# Altium project Main_board.PrjPcb
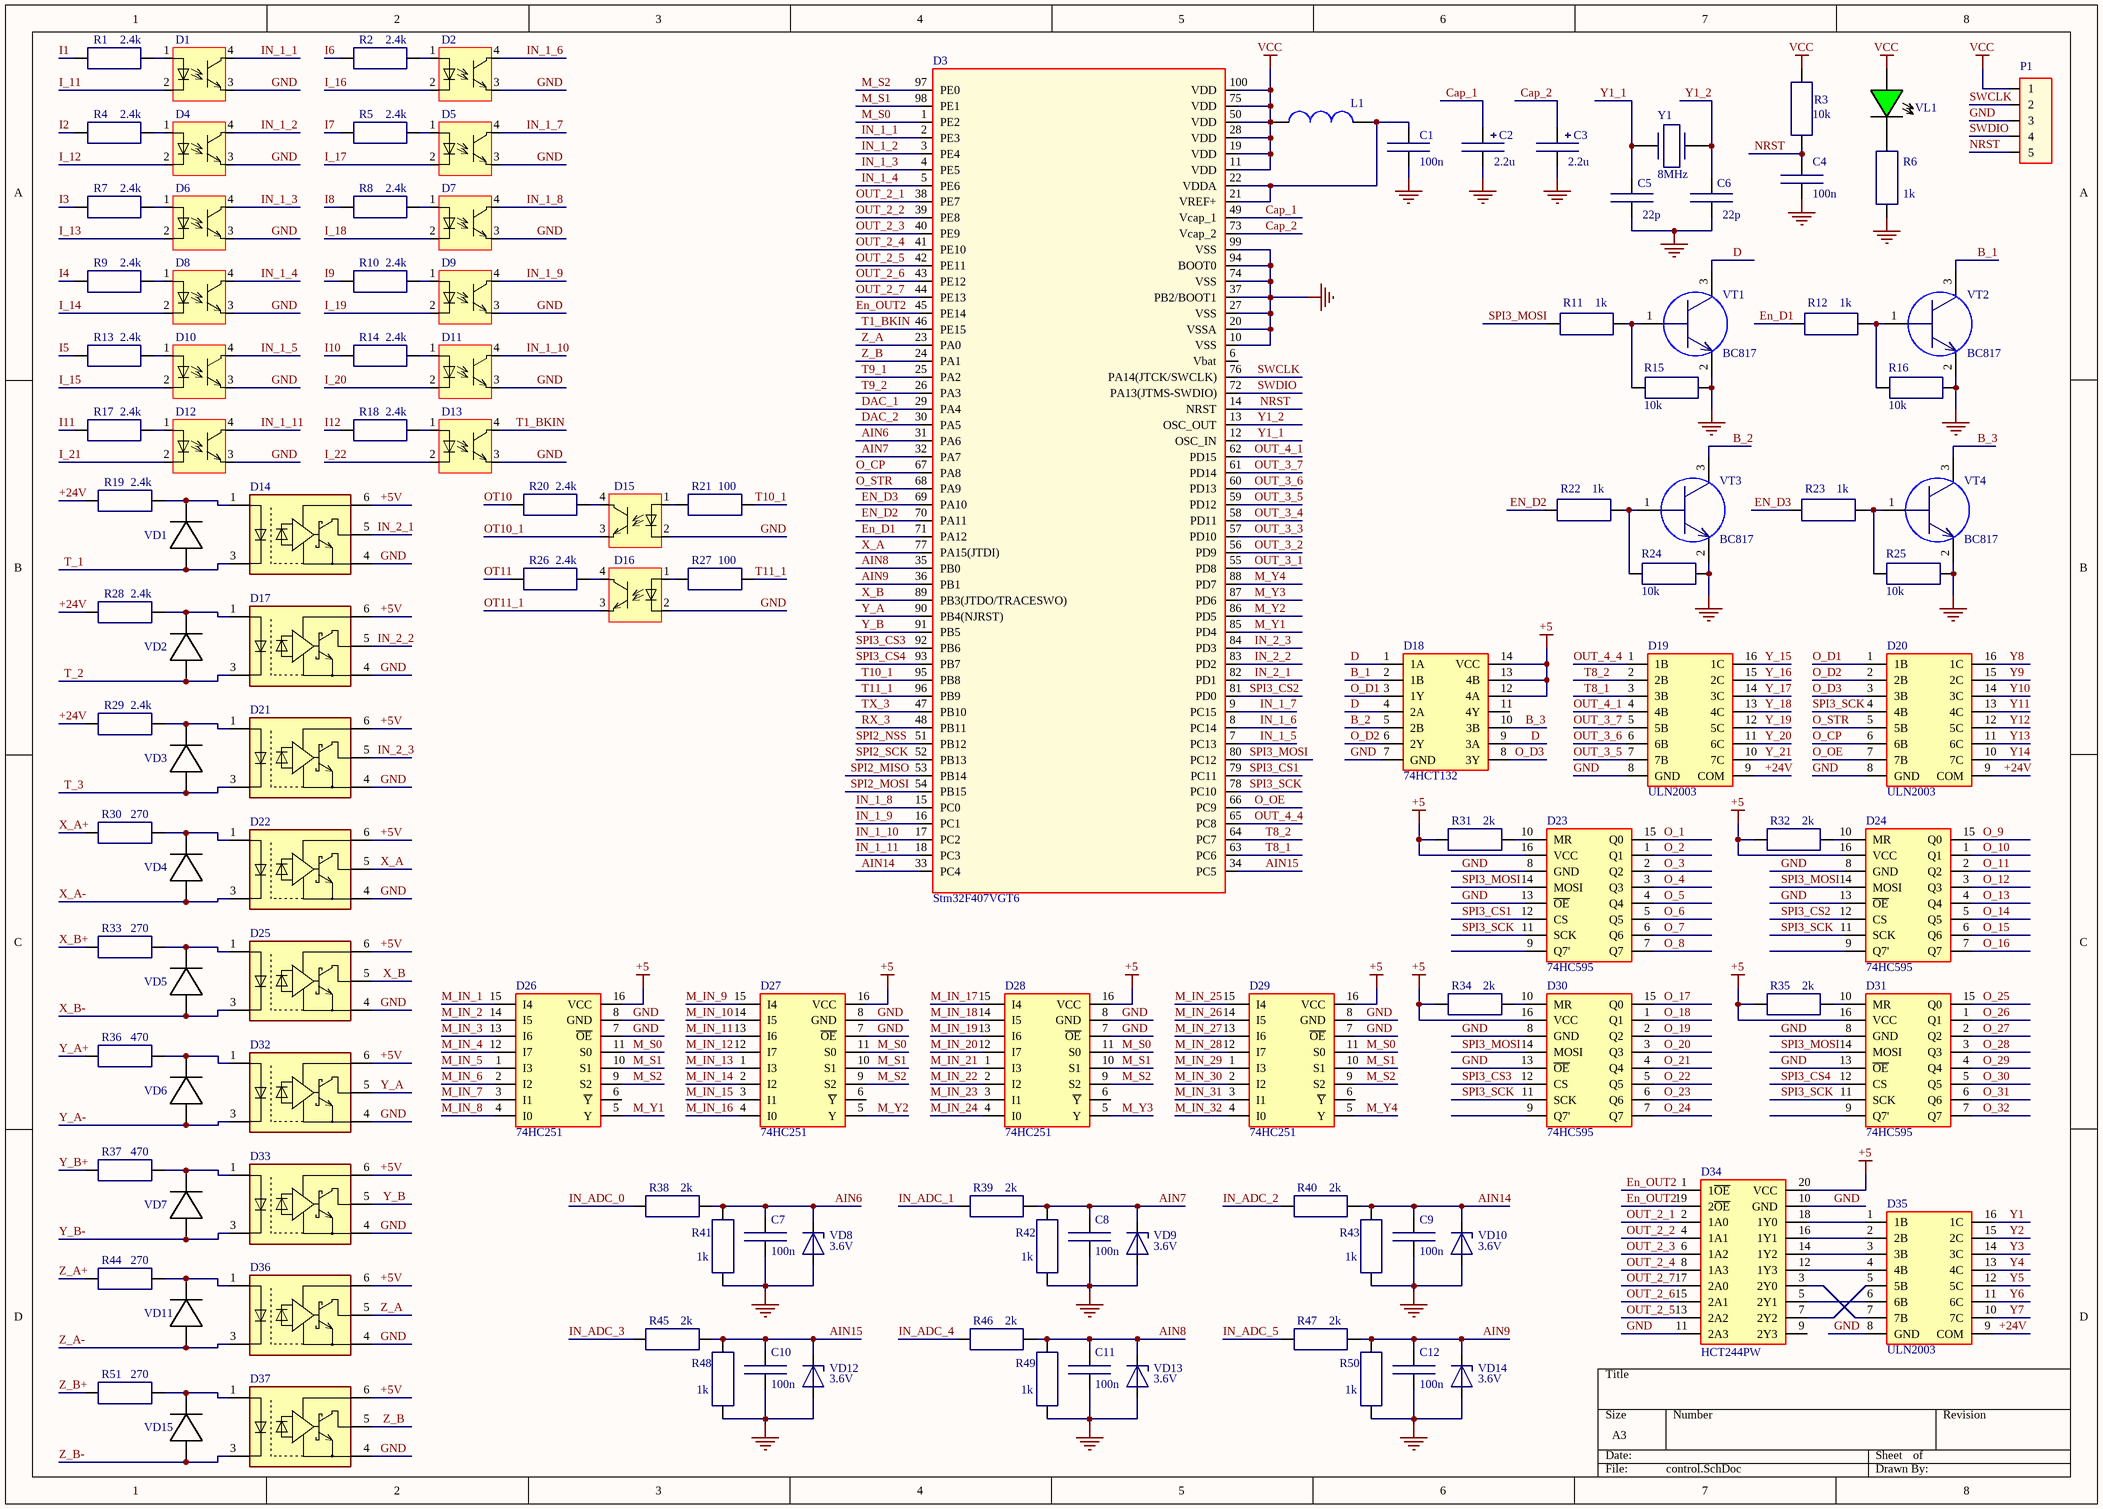
[diagram p0: control.SchDoc]
6 sheets, 333 parts. Net scope: global (net labels, ports and power ports of the same name join across sheets).
Board file: Bender_main.PcbDoc
Sheets:
  control.SchDoc
  control_2.SchDoc
  Res.SchDoc
  Supply.SchDoc
  Task.SchDoc
  connect.SchDoc

## Sheet control.SchDoc
size A3

### Parts
C1  100n  [C0805]
C2  2.2u  [R1206]
C3  2.2u  [R1206]
C4  100n  [C0805]
C5  22p  [C0805]
C6  22p  [C0805]
C7  100n  [C0805]
C8  100n  [C0805]
C9  100n  [C0805]
C10  100n  [C0805]
C11  100n  [C0805]
C12  100n  [C0805]
D1  hcpl-181  [SOP4]  (value not drawn)
D2  hcpl-181  [SOP4]  (value not drawn)
D3  Stm32F407VGT6  [LQFP100]
D4  hcpl-181  [SOP4]  (value not drawn)
D5  hcpl-181  [SOP4]  (value not drawn)
D6  hcpl-181  [SOP4]  (value not drawn)
D7  hcpl-181  [SOP4]  (value not drawn)
D8  hcpl-181  [SOP4]  (value not drawn)
D9  hcpl-181  [SOP4]  (value not drawn)
D10  hcpl-181  [SOP4]  (value not drawn)
D11  hcpl-181  [SOP4]  (value not drawn)
D12  hcpl-181  [SOP4]  (value not drawn)
D13  hcpl-181  [SOP4]  (value not drawn)
D14  LTV-601  [SOP5]  (value not drawn)
D15  hcpl-181  [SOP4]  (value not drawn)
D16  hcpl-181  [SOP4]  (value not drawn)
D17  LTV-601  [SOP5]  (value not drawn)
D18  74HCT132  [SO-14]
D19  ULN2003  [SOIC-16]
D20  ULN2003  [SOIC-16]
D21  LTV-601  [SOP5]  (value not drawn)
D22  LTV-601  [SOP5]  (value not drawn)
D23  74HC595  [SOP16_595]
D24  74HC595  [SOP16_595]
D25  LTV-601  [SOP5]  (value not drawn)
D26  74HC251  [SOP16_595]
D27  74HC251  [SOP16_595]
D28  74HC251  [SOP16_595]
D29  74HC251  [SOP16_595]
D30  74HC595  [SOP16_595]
D31  74HC595  [SOP16_595]
D32  LTV-601  [SOP5]  (value not drawn)
D33  LTV-601  [SOP5]  (value not drawn)
D34  HCT244PW  [TSSOP20]
D35  ULN2003  [SOIC-16]
D36  LTV-601  [SOP5]  (value not drawn)
D37  LTV-601  [SOP5]  (value not drawn)
L1  L  [L]  (value not drawn)
P1  Con_5  [Con_5]  (value not drawn)
R1  2.4k  [R1206]
R2  2.4k  [R1206]
R3  10k  [R0805]
R4  2.4k  [R1206]
R5  2.4k  [R1206]
R6  1k  [R0805]
R7  2.4k  [R1206]
R8  2.4k  [R1206]
R9  2.4k  [R1206]
R10  2.4k  [R1206]
R11  1k  [R0805]
R12  1k  [R0805]
R13  2.4k  [R1206]
R14  2.4k  [R1206]
R15  10k  [R0805]
R16  10k  [R0805]
R17  2.4k  [R1206]
R18  2.4k  [R1206]
R19  2.4k  [R1206]
R20  2.4k  [R1206]
R21  100  [R0805]
R22  1k  [R0805]
R23  1k  [R0805]
R24  10k  [R0805]
R25  10k  [R0805]
R26  2.4k  [R1206]
R27  100  [R0805]
R28  2.4k  [R1206]
R29  2.4k  [R1206]
R30  270  [R0805]
R31  2k  [R0805]
R32  2k  [R0805]
R33  270  [R0805]
R34  2k  [R0805]
R35  2k  [R0805]
R36  470  [R0805]
R37  470  [R0805]
R38  2k  [R0805]
R39  2k  [R0805]
R40  2k  [R0805]
R41  1k  [R0805]
R42  1k  [R0805]
R43  1k  [R0805]
R44  270  [R0805]
R45  2k  [R0805]
R46  2k  [R0805]
R47  2k  [R0805]
R48  1k  [R0805]
R49  1k  [R0805]
R50  1k  [R0805]
R51  270  [R0805]
VD1  LL4448  [R1206]  (value not drawn)
VD2  LL4448  [R1206]  (value not drawn)
VD3  LL4448  [R1206]  (value not drawn)
VD4  LL4448  [R1206]  (value not drawn)
VD5  LL4448  [R1206]  (value not drawn)
VD6  LL4448  [R1206]  (value not drawn)
VD7  LL4448  [R1206]  (value not drawn)
VD8  3.6V  [R1206]
VD9  3.6V  [R1206]
VD10  3.6V  [R1206]
VD11  LL4448  [R1206]  (value not drawn)
VD12  3.6V  [R1206]
VD13  3.6V  [R1206]
VD14  3.6V  [R1206]
VD15  LL4448  [R1206]  (value not drawn)
VL1  LED_1206  [R1206]  (value not drawn)
VT1  BC817  [SOT-23]
VT2  BC817  [SOT-23]
VT3  BC817  [SOT-23]
VT4  BC817  [SOT-23]
Y1  8MHz  [Crystal]

### Nets
+5V: D14.6 D17.6 D18.12(4A) D18.13(4B) D18.14(VCC) D21.6 D22.6 D23.16(VCC) D24.16(VCC) D25.6 D26.16(VCC) D27.16(VCC) D28.16(VCC) D29.16(VCC) D30.16(VCC) D31.16(VCC) D32.6 D33.6 D34.20(VCC) D36.6 D37.6 R31.2 R32.2 R34.2 R35.2  [also labelled +5]
GND: C1.2 C2.2 C3.2 C4.1 C5.2 C6.2 C7.2 C8.2 C9.2 C10.2 C11.2 C12.2 D1.3 D2.3 D3.10(VSS) D3.20(VSSA) D3.27(VSS) D3.37(PB2/BOOT1) D3.74(VSS) D3.94(BOOT0) D3.99(VSS) D4.3 D5.3 D6.3 D7.3 D8.3 D9.3 D10.3 D11.3 D12.3 D13.3 D14.4 D15.2 D16.2 D17.4 D18.7(GND) D19.8(GND) D20.8(GND) D21.4 D22.4 D23.8(GND) D23.13(~{OE}) D24.8(GND) D24.13(~{OE}) D25.4 D26.7(~{OE}) D26.8(GND) D27.7(~{OE}) D27.8(GND) D28.7(~{OE}) D28.8(GND) D29.7(~{OE}) D29.8(GND) D30.8(GND) D30.13(~{OE}) D31.8(GND) D31.13(~{OE}) D32.4 D33.4 D34.10(GND) D34.11(2A3) D35.8(GND) D36.4 D37.4 P1.3 R6.1 R15.1 R16.1 R24.1 R25.1 R41.1 R42.1 R43.1 R48.1 R49.1 R50.1 VD8.1 VD9.1 VD10.1 VD12.1 VD13.1 VD14.1 VT1.2 VT2.2 VT3.2 VT4.2
VCC: D3.11(VDD) D3.19(VDD) D3.28(VDD) D3.50(VDD) D3.75(VDD) D3.100(VDD) L1.1 P1.1 R3.1 VL1.1
+24V: D19.9(COM) D20.9(COM) D35.9(COM) R19.1 R28.1 R29.1
AIN6: C7.1 D3.31(PA6) R38.2 R41.2 VD8.2
AIN7: C8.1 D3.32(PA7) R39.2 R42.2 VD9.2
AIN8: C11.1 D3.35(PB0) R46.2 R49.2 VD13.2
AIN9: C12.1 D3.36(PB1) R47.2 R50.2 VD14.2
AIN14: C9.1 D3.33(PC4) R40.2 R43.2 VD10.2
AIN15: C10.1 D3.34(PC5) R45.2 R48.2 VD12.2
B_1: D18.2(1B) VT2.3
B_2: D18.5(2B) VT3.3
B_3: D18.10(3B) VT4.3
Cap_1: C2.1 D3.49(Vcap_1)
Cap_2: C3.1 D3.73(Vcap_2)
D: D18.1(1A) D18.4(2A) D18.9(3A) VT1.3
DAC_1: D3.29(PA4)
DAC_2: D3.30(PA5)
En_D1: D3.71(PA12) R12.1
EN_D2: D3.70(PA11) R22.1
EN_D3: D3.69(PA10) R23.1
En_OUT2: D3.45(PE14) D34.1(1~{OE}) D34.19(2~{OE})
I1: R1.1
I2: R4.1
I3: R7.1
I4: R9.1
I5: R13.1
I6: R2.1
I7: R5.1
I8: R8.1
I9: R10.1
I10: R14.1
I11: R17.1
I12: R18.1
I_11: D1.2
I_12: D4.2
I_13: D6.2
I_14: D8.2
I_15: D10.2
I_16: D2.2
I_17: D5.2
I_18: D7.2
I_19: D9.2
I_20: D11.2
I_21: D12.2
I_22: D13.2
IN_1_1: D1.4 D3.2(PE3)
IN_1_2: D3.3(PE4) D4.4
IN_1_3: D3.4(PE5) D6.4
IN_1_4: D3.5(PE6) D8.4
IN_1_5: D3.7(PC13) D10.4
IN_1_6: D2.4 D3.8(PC14)
IN_1_7: D3.9(PC15) D5.4
IN_1_8: D3.15(PC0) D7.4
IN_1_9: D3.16(PC1) D9.4
IN_1_10: D3.17(PC2) D11.4
IN_1_11: D3.18(PC3) D12.4
IN_2_1: D3.82(PD1) D14.5
IN_2_2: D3.83(PD2) D17.5
IN_2_3: D3.84(PD3) D21.5
IN_ADC_0: R38.1
IN_ADC_1: R39.1
IN_ADC_2: R40.1
IN_ADC_3: R45.1
IN_ADC_4: R46.1
IN_ADC_5: R47.1
M_IN_1: D26.15(I4)
M_IN_2: D26.14(I5)
M_IN_3: D26.13(I6)
M_IN_4: D26.12(I7)
M_IN_5: D26.1(I3)
M_IN_6: D26.2(I2)
M_IN_7: D26.3(I1)
M_IN_8: D26.4(I0)
M_IN_9: D27.15(I4)
M_IN_10: D27.14(I5)
M_IN_11: D27.13(I6)
M_IN_12: D27.12(I7)
M_IN_13: D27.1(I3)
M_IN_14: D27.2(I2)
M_IN_15: D27.3(I1)
M_IN_16: D27.4(I0)
M_IN_17: D28.15(I4)
M_IN_18: D28.14(I5)
M_IN_19: D28.13(I6)
M_IN_20: D28.12(I7)
M_IN_21: D28.1(I3)
M_IN_22: D28.2(I2)
M_IN_23: D28.3(I1)
M_IN_24: D28.4(I0)
M_IN_25: D29.15(I4)
M_IN_26: D29.14(I5)
M_IN_27: D29.13(I6)
M_IN_28: D29.12(I7)
M_IN_29: D29.1(I3)
M_IN_30: D29.2(I2)
M_IN_31: D29.3(I1)
M_IN_32: D29.4(I0)
M_S0: D3.1(PE2) D26.11(S0) D27.11(S0) D28.11(S0) D29.11(S0)
M_S1: D3.98(PE1) D26.10(S1) D27.10(S1) D28.10(S1) D29.10(S1)
M_S2: D3.97(PE0) D26.9(S2) D27.9(S2) D28.9(S2) D29.9(S2)
M_Y1: D3.85(PD4) D26.5(Y)
M_Y2: D3.86(PD5) D27.5(Y)
M_Y3: D3.87(PD6) D28.5(Y)
M_Y4: D3.88(PD7) D29.5(Y)
NRST: C4.2 D3.14(NRST) P1.5 R3.2
O_1: D23.15(Q0)
O_2: D23.1(Q1)
O_3: D23.2(Q2)
O_4: D23.3(Q3)
O_5: D23.4(Q4)
O_6: D23.5(Q5)
O_7: D23.6(Q6)
O_8: D23.7(Q7)
O_9: D24.15(Q0)
O_10: D24.1(Q1)
O_11: D24.2(Q2)
O_12: D24.3(Q3)
O_13: D24.4(Q4)
O_14: D24.5(Q5)
O_15: D24.6(Q6)
O_16: D24.7(Q7)
O_17: D30.15(Q0)
O_18: D30.1(Q1)
O_19: D30.2(Q2)
O_20: D30.3(Q3)
O_21: D30.4(Q4)
O_22: D30.5(Q5)
O_23: D30.6(Q6)
O_24: D30.7(Q7)
O_25: D31.15(Q0)
O_26: D31.1(Q1)
O_27: D31.2(Q2)
O_28: D31.3(Q3)
O_29: D31.4(Q4)
O_30: D31.5(Q5)
O_31: D31.6(Q6)
O_32: D31.7(Q7)
O_CP: D3.67(PA8) D20.6(6B)
O_D1: D18.3(1Y) D20.1(1B)
O_D2: D18.6(2Y) D20.2(2B)
O_D3: D18.8(3Y) D20.3(3B)
O_OE: D3.66(PC9) D20.7(7B)
O_STR: D3.68(PA9) D20.5(5B)
OT10: R20.1
OT10_1: D15.3
OT11: R26.1
OT11_1: D16.3
OUT_2_1: D3.38(PE7) D34.2(1A0)
OUT_2_2: D3.39(PE8) D34.4(1A1)
OUT_2_3: D3.40(PE9) D34.6(1A2)
OUT_2_4: D3.41(PE10) D34.8(1A3)
OUT_2_5: D3.42(PE11) D34.13(2A2)
OUT_2_6: D3.43(PE12) D34.15(2A1)
OUT_2_7: D3.44(PE13) D34.17(2A0)
OUT_3_1: D3.55(PD8)
OUT_3_2: D3.56(PD9)
OUT_3_3: D3.57(PD10)
OUT_3_4: D3.58(PD11)
OUT_3_5: D3.59(PD12) D19.7(7B)
OUT_3_6: D3.60(PD13) D19.6(6B)
OUT_3_7: D3.61(PD14) D19.5(5B)
OUT_4_1: D3.62(PD15) D19.4(4B)
OUT_4_4: D3.65(PC8) D19.1(1B)
RX_3: D3.48(PB11)
SPI2_MISO: D3.53(PB14)
SPI2_MOSI: D3.54(PB15)
SPI2_NSS: D3.51(PB12)
SPI2_SCK: D3.52(PB13)
SPI3_CS1: D3.79(PC11) D23.12(CS)
SPI3_CS2: D3.81(PD0) D24.12(CS)
SPI3_CS3: D3.92(PB6) D30.12(CS)
SPI3_CS4: D3.93(PB7) D31.12(CS)
SPI3_MOSI: D3.80(PC12) D23.14(MOSI) D24.14(MOSI) D30.14(MOSI) D31.14(MOSI) R11.1
SPI3_SCK: D3.78(PC10) D20.4(4B) D23.11(SCK) D24.11(SCK) D30.11(SCK) D31.11(SCK)
SWCLK: D3.76(PA14(JTCK/SWCLK)) P1.2
SWDIO: D3.72(PA13(JTMS-SWDIO)) P1.4
T1_BKIN: D3.46(PE15) D13.4
T8_1: D3.63(PC6) D19.3(3B)
T8_2: D3.64(PC7) D19.2(2B)
T9_1: D3.25(PA2)
T9_2: D3.26(PA3)
T10_1: D3.95(PB8) R21.2
T11_1: D3.96(PB9) R27.2
T_1: D14.3 VD1.1
T_2: D17.3 VD2.1
T_3: D21.3 VD3.1
TX_3: D3.47(PB10)
X_A: D3.77(PA15(JTDI)) D22.5
X_A+: R30.1
X_A-: D22.3 VD4.1
X_B: D3.89(PB3(JTDO/TRACESWO)) D25.5
X_B+: R33.1
X_B-: D25.3 VD5.1
Y1: D35.16(1C)
Y1_1: C5.1 D3.12(OSC_IN) Y1.2
Y1_2: C6.1 D3.13(OSC_OUT) Y1.1
Y2: D35.15(2C)
Y3: D35.14(3C)
Y4: D35.13(4C)
Y5: D35.12(5C)
Y6: D35.11(6C)
Y7: D35.10(7C)
Y8: D20.16(1C)
Y9: D20.15(2C)
Y10: D20.14(3C)
Y11: D20.13(4C)
Y12: D20.12(5C)
Y13: D20.11(6C)
Y14: D20.10(7C)
Y_15: D19.16(1C)
Y_16: D19.15(2C)
Y_17: D19.14(3C)
Y_18: D19.13(4C)
Y_19: D19.12(5C)
Y_20: D19.11(6C)
Y_21: D19.10(7C)
Y_A: D3.90(PB4(NJRST)) D32.5
Y_A+: R36.1
Y_A-: D32.3 VD6.1
Y_B: D3.91(PB5) D33.5
Y_B+: R37.1
Y_B-: D33.3 VD7.1
Z_A: D3.23(PA0) D36.5
Z_A+: R44.1
Z_A-: D36.3 VD11.1
Z_B: D3.24(PA1) D37.5
Z_B+: R51.1
Z_B-: D37.3 VD15.1
NetC1_1: C1.1 D3.21(VREF+) D3.22(VDDA) L1.2
NetD1_1: D1.1 R1.2
NetD2_1: D2.1 R2.2
NetD4_1: D4.1 R4.2
NetD5_1: D5.1 R5.2
NetD6_1: D6.1 R7.2
NetD7_1: D7.1 R8.2
NetD8_1: D8.1 R9.2
NetD9_1: D9.1 R10.2
NetD10_1: D10.1 R13.2
NetD11_1: D11.1 R14.2
NetD12_1: D12.1 R17.2
NetD13_1: D13.1 R18.2
NetD14_1: D14.1 R19.2 VD1.2
NetD15_1: D15.1 R21.1
NetD15_4: D15.4 R20.2
NetD16_1: D16.1 R27.1
NetD16_4: D16.4 R26.2
NetD17_1: D17.1 R28.2 VD2.2
NetD21_1: D21.1 R29.2 VD3.2
NetD22_1: D22.1 R30.2 VD4.2
NetD23_10: D23.10(MR) R31.1
NetD24_10: D24.10(MR) R32.1
NetD25_1: D25.1 R33.2 VD5.2
NetD30_10: D30.10(MR) R34.1
NetD31_10: D31.10(MR) R35.1
NetD32_1: D32.1 R36.2 VD6.2
NetD33_1: D33.1 R37.2 VD7.2
NetD34_3: D34.3(2Y0) D35.7(7B)
NetD34_5: D34.5(2Y1) D35.6(6B)
NetD34_7: D34.7(2Y2) D35.5(5B)
NetD34_12: D34.12(1Y3) D35.4(4B)
NetD34_14: D34.14(1Y2) D35.3(3B)
NetD34_16: D34.16(1Y1) D35.2(2B)
NetD34_18: D34.18(1Y0) D35.1(1B)
NetD36_1: D36.1 R44.2 VD11.2
NetD37_1: D37.1 R51.2 VD15.2
NetR6_2: R6.2 VL1.2
NetR11_2: R11.2 R15.2 VT1.1
NetR12_2: R12.2 R16.2 VT2.1
NetR22_2: R22.2 R24.2 VT3.1
NetR23_2: R23.2 R25.2 VT4.1

Not connected (* = marked no-connect by the designer): D3 6(Vbat); D18 11(4Y); D23 9(Q7'); D24 9(Q7'); D26 6(~{Y}); D27 6(~{Y}); D28 6(~{Y}); D29 6(~{Y}); D30 9(Q7'); D31 9(Q7'); D34 9(2Y3)

### Library data of the parts
C1 C4-C12 = C0805
C2 C3 = Tantal_2.2
R1 R2 R4 R5 R7-R10 R13 R14 R17-R20 R26 R28 R29 = R1206
R3 R6 R11 R12 R15 R16 R21-R25 R27 R30-R51 = R0805
VD8-VD10 VD12-VD14 = Zener
VT1-VT4 = NPN
Y1 = Crystal

## Sheet control_2.SchDoc
size A4
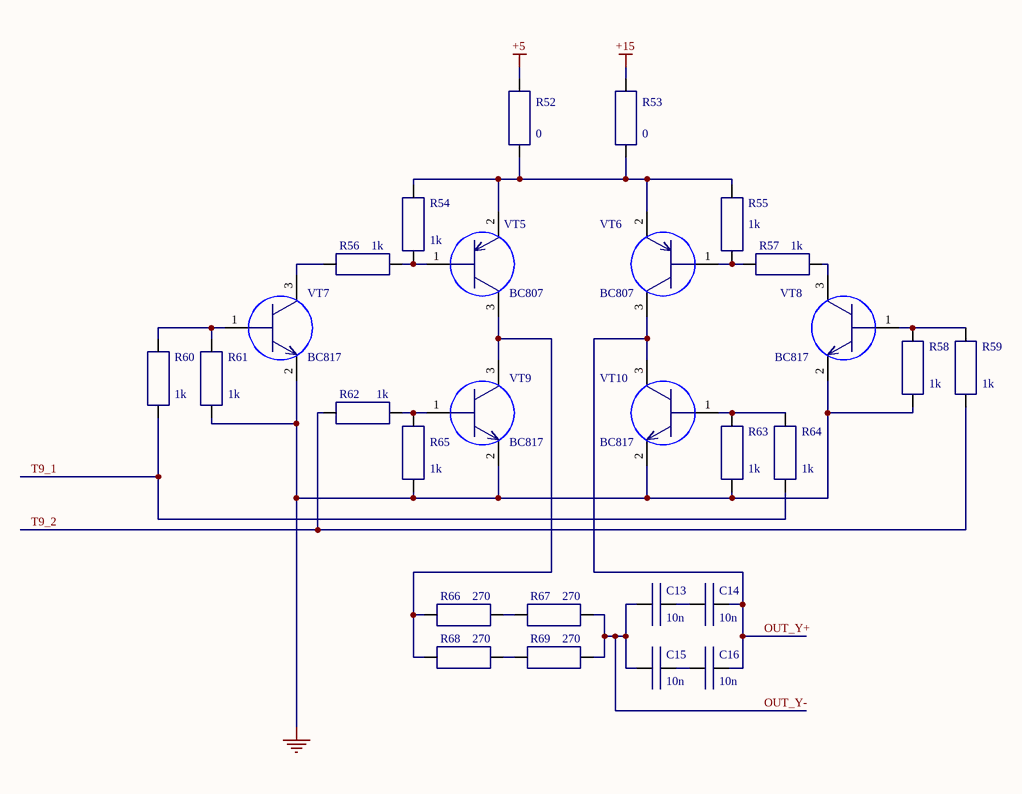
[diagram p1: control_2.SchDoc]

### Parts
C13  10n  [C0805]
C14  10n  [C0805]
C15  10n  [C0805]
C16  10n  [C0805]
R52  0  [R1206]
R53  0  [R1206]
R54  1k  [R0805]
R55  1k  [R0805]
R56  1k  [R0805]
R57  1k  [R0805]
R58  1k  [R0805]
R59  1k  [R0805]
R60  1k  [R0805]
R61  1k  [R0805]
R62  1k  [R0805]
R63  1k  [R0805]
R64  1k  [R0805]
R65  1k  [R0805]
R66  270  [R1206]
R67  270  [R1206]
R68  270  [R1206]
R69  270  [R1206]
VT5  BC807  [SOT-23]
VT6  BC807  [SOT-23]
VT7  BC817  [SOT-23]
VT8  BC817  [SOT-23]
VT9  BC817  [SOT-23]
VT10  BC817  [SOT-23]

### Nets
+5: R52.2  [project net +5V]
+15: R53.2
GND: R58.1 R61.1 R63.1 R65.1 VT7.2 VT8.2 VT9.2 VT10.2
OUT_Y+: C14.1 C16.1 VT6.3 VT10.3
OUT_Y-: C13.2 C15.2 R67.1 R69.1
T9_1: R60.1 R64.1
T9_2: R59.1 R62.2
NetC13_1: C13.1 C14.2
NetC15_1: C15.1 C16.2
NetR52_1: R52.1 R53.1 R54.2 R55.2 VT5.2 VT6.2
NetR54_1: R54.1 R56.1 VT5.1
NetR55_1: R55.1 R57.2 VT6.1
NetR56_2: R56.2 VT7.3
NetR57_1: R57.1 VT8.3
NetR58_2: R58.2 R59.2 VT8.1
NetR60_2: R60.2 R61.2 VT7.1
NetR62_1: R62.1 R65.2 VT9.1
NetR63_2: R63.2 R64.2 VT10.1
NetR66_1: R66.1 R67.2
NetR66_2: R66.2 R68.2 VT5.3 VT9.3
NetR68_1: R68.1 R69.2

### Library data of the parts
C13-C16 = C0805
R52 R53 R66-R69 = R1206
R54-R65 = R0805
VT5 VT6 = PNP
VT7-VT10 = NPN

## Sheet Res.SchDoc
size A4
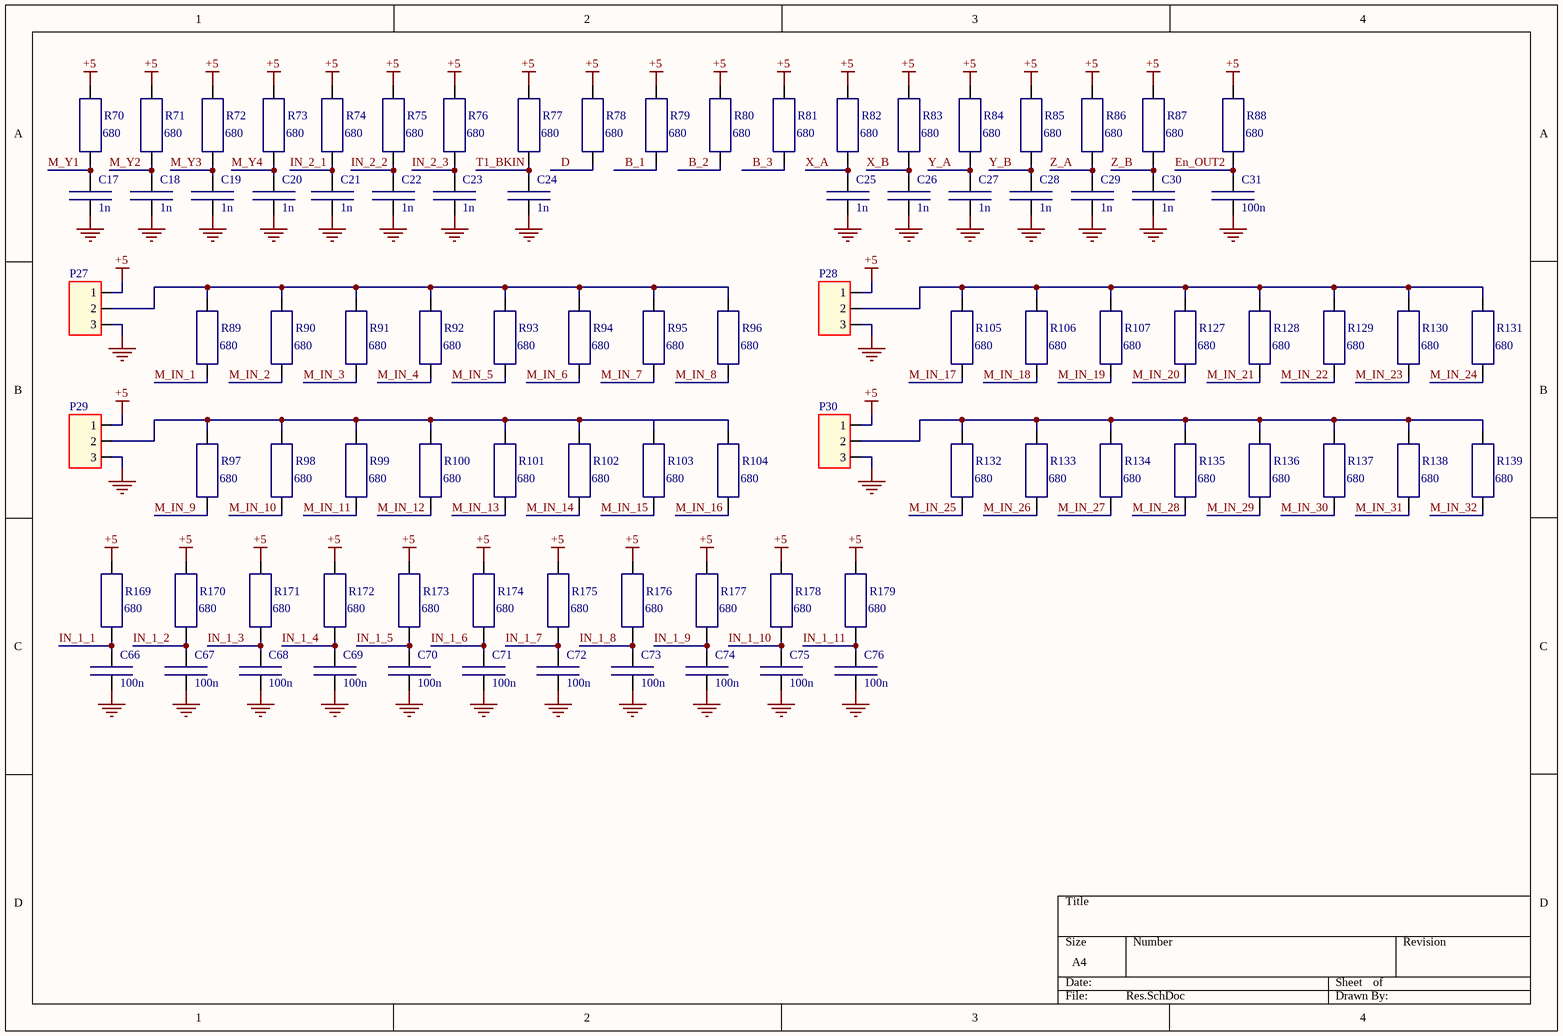
[diagram p2: Res.SchDoc]

### Parts
C17  1n  [C0805]
C18  1n  [C0805]
C19  1n  [C0805]
C20  1n  [C0805]
C21  1n  [C0805]
C22  1n  [C0805]
C23  1n  [C0805]
C24  1n  [C0805]
C25  1n  [C0805]
C26  1n  [C0805]
C27  1n  [C0805]
C28  1n  [C0805]
C29  1n  [C0805]
C30  1n  [C0805]
C31  100n  [C0805]
C66  100n  [C0805]
C67  100n  [C0805]
C68  100n  [C0805]
C69  100n  [C0805]
C70  100n  [C0805]
C71  100n  [C0805]
C72  100n  [C0805]
C73  100n  [C0805]
C74  100n  [C0805]
C75  100n  [C0805]
C76  100n  [C0805]
P27  Con_3  [CON_3]  (value not drawn)
P28  Con_3  [CON_3]  (value not drawn)
P29  Con_3  [CON_3]  (value not drawn)
P30  Con_3  [CON_3]  (value not drawn)
R70  680  [R0805]
R71  680  [R0805]
R72  680  [R0805]
R73  680  [R0805]
R74  680  [R0805]
R75  680  [R0805]
R76  680  [R0805]
R77  680  [R0805]
R78  680  [R0805]
R79  680  [R0805]
R80  680  [R0805]
R81  680  [R0805]
R82  680  [R0805]
R83  680  [R0805]
R84  680  [R0805]
R85  680  [R0805]
R86  680  [R0805]
R87  680  [R0805]
R88  680  [R0805]
R89  680  [R0805]
R90  680  [R0805]
R91  680  [R0805]
R92  680  [R0805]
R93  680  [R0805]
R94  680  [R0805]
R95  680  [R0805]
R96  680  [R0805]
R97  680  [R0805]
R98  680  [R0805]
R99  680  [R0805]
R100  680  [R0805]
R101  680  [R0805]
R102  680  [R0805]
R103  680  [R0805]
R104  680  [R0805]
R105  680  [R0805]
R106  680  [R0805]
R107  680  [R0805]
R127  680  [R0805]
R128  680  [R0805]
R129  680  [R0805]
R130  680  [R0805]
R131  680  [R0805]
R132  680  [R0805]
R133  680  [R0805]
R134  680  [R0805]
R135  680  [R0805]
R136  680  [R0805]
R137  680  [R0805]
R138  680  [R0805]
R139  680  [R0805]
R169  680  [R0805]
R170  680  [R0805]
R171  680  [R0805]
R172  680  [R0805]
R173  680  [R0805]
R174  680  [R0805]
R175  680  [R0805]
R176  680  [R0805]
R177  680  [R0805]
R178  680  [R0805]
R179  680  [R0805]

### Nets
+5: P27.1 P28.1 P29.1 P30.1 R70.2 R71.2 R72.2 R73.2 R74.2 R75.2 R76.2 R77.2 R78.2 R79.2 R80.2 R81.2 R82.2 R83.2 R84.2 R85.2 R86.2 R87.2 R88.2 R169.2 R170.2 R171.2 R172.2 R173.2 R174.2 R175.2 R176.2 R177.2 R178.2 R179.2  [project net +5V]
GND: C17.2 C18.2 C19.2 C20.2 C21.2 C22.2 C23.2 C24.2 C25.2 C26.2 C27.2 C28.2 C29.2 C30.2 C31.2 C66.2 C67.2 C68.2 C69.2 C70.2 C71.2 C72.2 C73.2 C74.2 C75.2 C76.2 P27.3 P28.3 P29.3 P30.3
B_1: R79.1
B_2: R80.1
B_3: R81.1
D: R78.1
En_OUT2: C31.1 R88.1
IN_1_1: C66.1 R169.1
IN_1_2: C67.1 R170.1
IN_1_3: C68.1 R171.1
IN_1_4: C69.1 R172.1
IN_1_5: C70.1 R173.1
IN_1_6: C71.1 R174.1
IN_1_7: C72.1 R175.1
IN_1_8: C73.1 R176.1
IN_1_9: C74.1 R177.1
IN_1_10: C75.1 R178.1
IN_1_11: C76.1 R179.1
IN_2_1: C21.1 R74.1
IN_2_2: C22.1 R75.1
IN_2_3: C23.1 R76.1
M_IN_1: R89.1
M_IN_2: R90.1
M_IN_3: R91.1
M_IN_4: R92.1
M_IN_5: R93.1
M_IN_6: R94.1
M_IN_7: R95.1
M_IN_8: R96.1
M_IN_9: R97.1
M_IN_10: R98.1
M_IN_11: R99.1
M_IN_12: R100.1
M_IN_13: R101.1
M_IN_14: R102.1
M_IN_15: R103.1
M_IN_16: R104.1
M_IN_17: R105.1
M_IN_18: R106.1
M_IN_19: R107.1
M_IN_20: R127.1
M_IN_21: R128.1
M_IN_22: R129.1
M_IN_23: R130.1
M_IN_24: R131.1
M_IN_25: R132.1
M_IN_26: R133.1
M_IN_27: R134.1
M_IN_28: R135.1
M_IN_29: R136.1
M_IN_30: R137.1
M_IN_31: R138.1
M_IN_32: R139.1
M_Y1: C17.1 R70.1
M_Y2: C18.1 R71.1
M_Y3: C19.1 R72.1
M_Y4: C20.1 R73.1
T1_BKIN: C24.1 R77.1
X_A: C25.1 R82.1
X_B: C26.1 R83.1
Y_A: C27.1 R84.1
Y_B: C28.1 R85.1
Z_A: C29.1 R86.1
Z_B: C30.1 R87.1
NetP27_2: P27.2 R89.2 R90.2 R91.2 R92.2 R93.2 R94.2 R95.2 R96.2
NetP28_2: P28.2 R105.2 R106.2 R107.2 R127.2 R128.2 R129.2 R130.2 R131.2
NetP29_2: P29.2 R97.2 R98.2 R99.2 R100.2 R101.2 R102.2 R103.2 R104.2
NetP30_2: P30.2 R132.2 R133.2 R134.2 R135.2 R136.2 R137.2 R138.2 R139.2

### Library data of the parts
C17-C31 C66-C76 = C0805
R70-R107 R127-R139 R169-R179 = R0805

## Sheet Supply.SchDoc
size A4
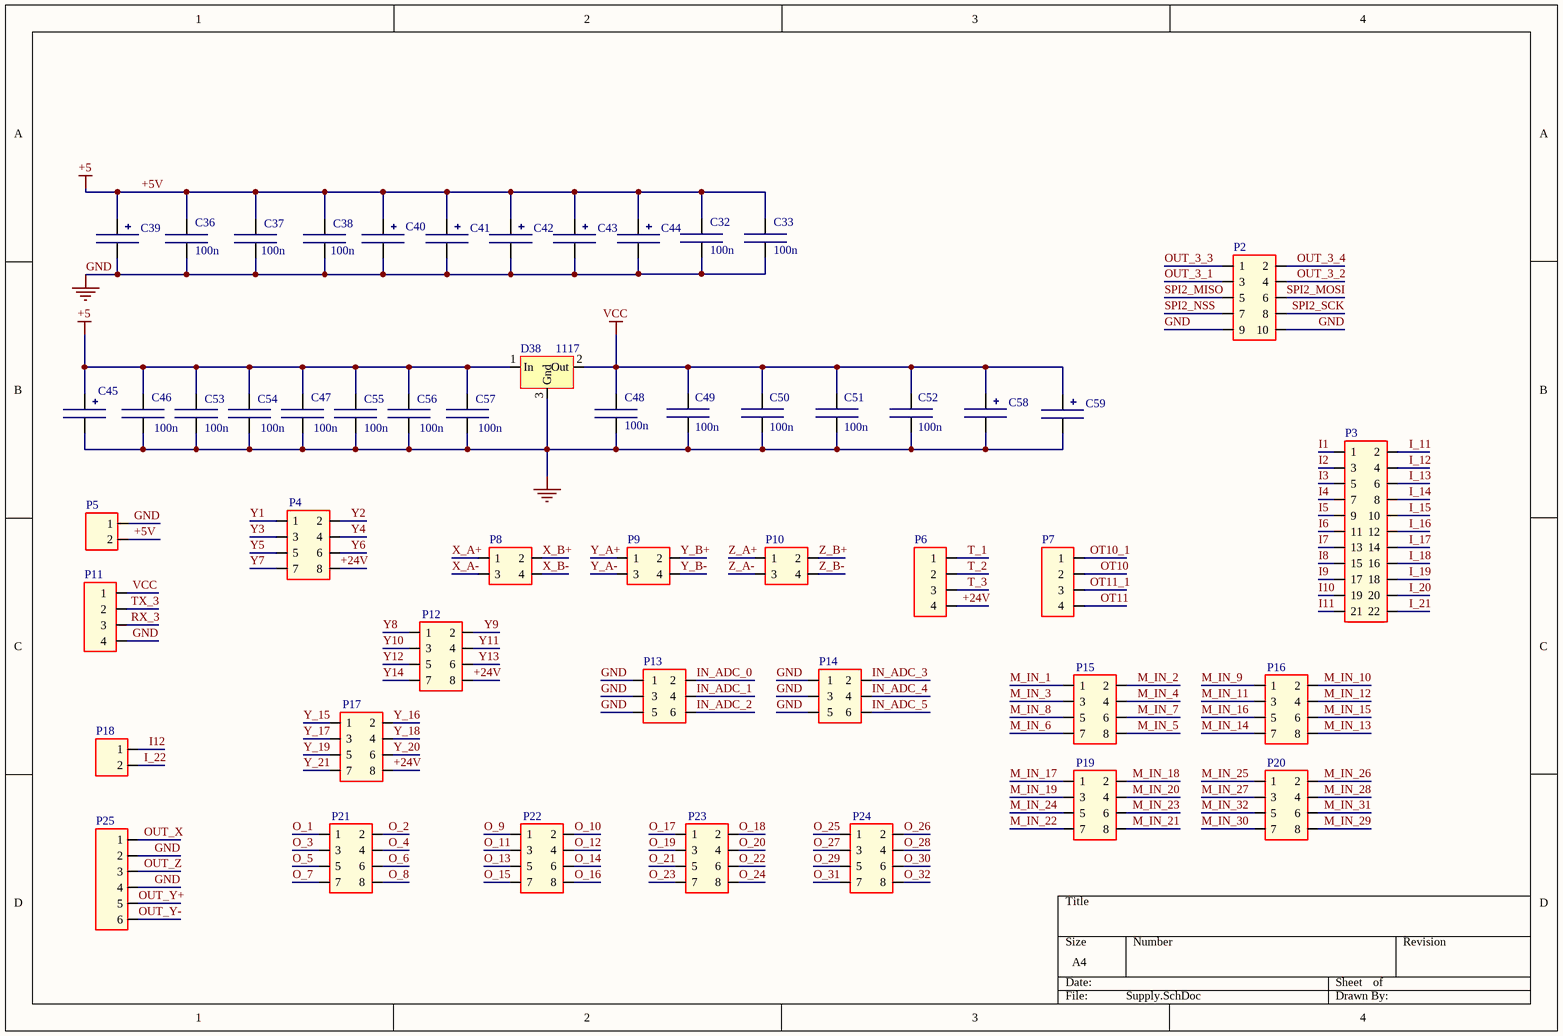
[diagram p3: Supply.SchDoc]

### Parts
(Parts that share a designator on the sheet are numbered #1, #2 ... from top to bottom, then left to right.)
C32  100n  [C0805]
C33  100n  [C0805]
C36  100n  [C0805]
C37  100n  [C0805]
C38  100n  [C0805]
C39  Capacitor_Polyar  [SMD_El_SizeA]  (value not drawn)
C40  Capacitor_Polyar  [SMD_El_SizeA]  (value not drawn)
C41  Capacitor_Polyar  [SMD_El_SizeA]  (value not drawn)
C42  Capacitor_Polyar  [SMD_El_SizeA]  (value not drawn)
C43  Capacitor_Polyar  [SMD_El_SizeA]  (value not drawn)
C44  Capacitor_Polyar  [SMD_El_SizeA]  (value not drawn)
C45  Capacitor_Polyar  [SMD_El_SizeA]  (value not drawn)
C46  100n  [C0805]
C47  100n  [C0805]
C48  100n  [C0805]
C49  100n  [C0805]
C50  100n  [C0805]
C51  100n  [C0805]
C52  100n  [C0805]
C53  100n  [C0805]
C54  100n  [C0805]
C55  100n  [C0805]
C56  100n  [C0805]
C57  100n  [C0805]
C58  Capacitor_Polyar  [SMD_El_SizeA]  (value not drawn)
C59  Capacitor_Polyar  [SMD_El_SizeA]  (value not drawn)
D38  1117  [SOT223]
P2  Con_5x2  [Con_5x2]  (value not drawn)
P3#1  Con_11x2  [Con_11x2]  (value not drawn)
P4  Con_4x2  [Con_4_2]  (value not drawn)
P5  KLS_2  [KLS-2]  (value not drawn)
P6#1  Con_4  [Con_4]  (value not drawn)
P7  Con_4  [Con_4]  (value not drawn)
P8#1  Con_2x2  [Con_2x2]  (value not drawn)
P9#1  Con_2x2  [Con_2x2]  (value not drawn)
P10#1  Con_2x2  [Con_2x2]  (value not drawn)
P11  Con_4  [Con_4]  (value not drawn)
P12#1  Con_4x2  [Con_4_2]  (value not drawn)
P13  Con_3x2  [Con_3x2]  (value not drawn)
P14  Con_3x2  [Con_3x2]  (value not drawn)
P15#1  Con_4x2  [Con_4_2]  (value not drawn)
P16#1  Con_4x2  [Con_4_2]  (value not drawn)
P17  Con_4x2  [Con_4_2]  (value not drawn)
P18  KLS_2  [KLS-2]  (value not drawn)
P19#1  Con_4x2  [Con_4_2]  (value not drawn)
P20#1  Con_4x2  [Con_4_2]  (value not drawn)
P21  Con_4x2  [Con_4_2]  (value not drawn)
P22  Con_4x2  [Con_4_2]  (value not drawn)
P23  Con_4x2  [Con_4_2]  (value not drawn)
P24  Con_4x2  [Con_4_2]  (value not drawn)
P25#1  KLS_6_5mm  [KLS_6_5MM]  (value not drawn)

### Nets
+5V: C32.1 C33.1 C36.1 C37.1 C38.1 C39.1 C40.1 C41.1 C42.1 C43.1 C44.1 C45.1 C46.1 C47.1 C53.1 C54.1 C55.1 C56.1 C57.1 D38.1(In) P5.2  [also labelled +5]
GND: C32.2 C33.2 C36.2 C37.2 C38.2 C39.2 C40.2 C41.2 C42.2 C43.2 C44.2 C45.2 C46.2 C47.2 C48.2 C49.2 C50.2 C51.2 C52.2 C53.2 C54.2 C55.2 C56.2 C57.2 C58.2 C59.2 D38.3(Gnd) P2.9 P2.10 P5.1 P11.4 P13.1 P13.3 P13.5 P14.1 P14.3 P14.5 P25#1.2 P25#1.4
VCC: C48.1 C49.1 C50.1 C51.1 C52.1 C58.1 C59.1 D38.2(Out) P11.1
+24V: P4.8 P6#1.4 P12#1.8 P17.8
I1: P3#1.1
I2: P3#1.3
I3: P3#1.5
I4: P3#1.7
I5: P3#1.9
I6: P3#1.11
I7: P3#1.13
I8: P3#1.15
I9: P3#1.17
I10: P3#1.19
I11: P3#1.21
I12: P18.1
I_11: P3#1.2
I_12: P3#1.4
I_13: P3#1.6
I_14: P3#1.8
I_15: P3#1.10
I_16: P3#1.12
I_17: P3#1.14
I_18: P3#1.16
I_19: P3#1.18
I_20: P3#1.20
I_21: P3#1.22
I_22: P18.2
IN_ADC_0: P13.2
IN_ADC_1: P13.4
IN_ADC_2: P13.6
IN_ADC_3: P14.2
IN_ADC_4: P14.4
IN_ADC_5: P14.6
M_IN_1: P15#1.1
M_IN_2: P15#1.2
M_IN_3: P15#1.3
M_IN_4: P15#1.4
M_IN_5: P15#1.8
M_IN_6: P15#1.7
M_IN_7: P15#1.6
M_IN_8: P15#1.5
M_IN_9: P16#1.1
M_IN_10: P16#1.2
M_IN_11: P16#1.3
M_IN_12: P16#1.4
M_IN_13: P16#1.8
M_IN_14: P16#1.7
M_IN_15: P16#1.6
M_IN_16: P16#1.5
M_IN_17: P19#1.1
M_IN_18: P19#1.2
M_IN_19: P19#1.3
M_IN_20: P19#1.4
M_IN_21: P19#1.8
M_IN_22: P19#1.7
M_IN_23: P19#1.6
M_IN_24: P19#1.5
M_IN_25: P20#1.1
M_IN_26: P20#1.2
M_IN_27: P20#1.3
M_IN_28: P20#1.4
M_IN_29: P20#1.8
M_IN_30: P20#1.7
M_IN_31: P20#1.6
M_IN_32: P20#1.5
O_1: P21.1
O_2: P21.2
O_3: P21.3
O_4: P21.4
O_5: P21.5
O_6: P21.6
O_7: P21.7
O_8: P21.8
O_9: P22.1
O_10: P22.2
O_11: P22.3
O_12: P22.4
O_13: P22.5
O_14: P22.6
O_15: P22.7
O_16: P22.8
O_17: P23.1
O_18: P23.2
O_19: P23.3
O_20: P23.4
O_21: P23.5
O_22: P23.6
O_23: P23.7
O_24: P23.8
O_25: P24.1
O_26: P24.2
O_27: P24.3
O_28: P24.4
O_29: P24.5
O_30: P24.6
O_31: P24.7
O_32: P24.8
OT10: P7.2
OT10_1: P7.1
OT11: P7.4
OT11_1: P7.3
OUT_3_1: P2.3
OUT_3_2: P2.4
OUT_3_3: P2.1
OUT_3_4: P2.2
OUT_X: P25#1.1
OUT_Y+: P25#1.5
OUT_Y-: P25#1.6
OUT_Z: P25#1.3
RX_3: P11.3
SPI2_MISO: P2.5
SPI2_MOSI: P2.6
SPI2_NSS: P2.7
SPI2_SCK: P2.8
T_1: P6#1.1
T_2: P6#1.2
T_3: P6#1.3
TX_3: P11.2
X_A+: P8#1.1
X_A-: P8#1.3
X_B+: P8#1.2
X_B-: P8#1.4
Y1: P4.1
Y2: P4.2
Y3: P4.3
Y4: P4.4
Y5: P4.5
Y6: P4.6
Y7: P4.7
Y8: P12#1.1
Y9: P12#1.2
Y10: P12#1.3
Y11: P12#1.4
Y12: P12#1.5
Y13: P12#1.6
Y14: P12#1.7
Y_15: P17.1
Y_16: P17.2
Y_17: P17.3
Y_18: P17.4
Y_19: P17.5
Y_20: P17.6
Y_21: P17.7
Y_A+: P9#1.1
Y_A-: P9#1.3
Y_B+: P9#1.2
Y_B-: P9#1.4
Z_A+: P10#1.1
Z_A-: P10#1.3
Z_B+: P10#1.2
Z_B-: P10#1.4

### Library data of the parts
C32 C33 C36-C38 C46-C57 = C0805
D38 = 7833_SOT223

## Sheet Task.SchDoc
size A4
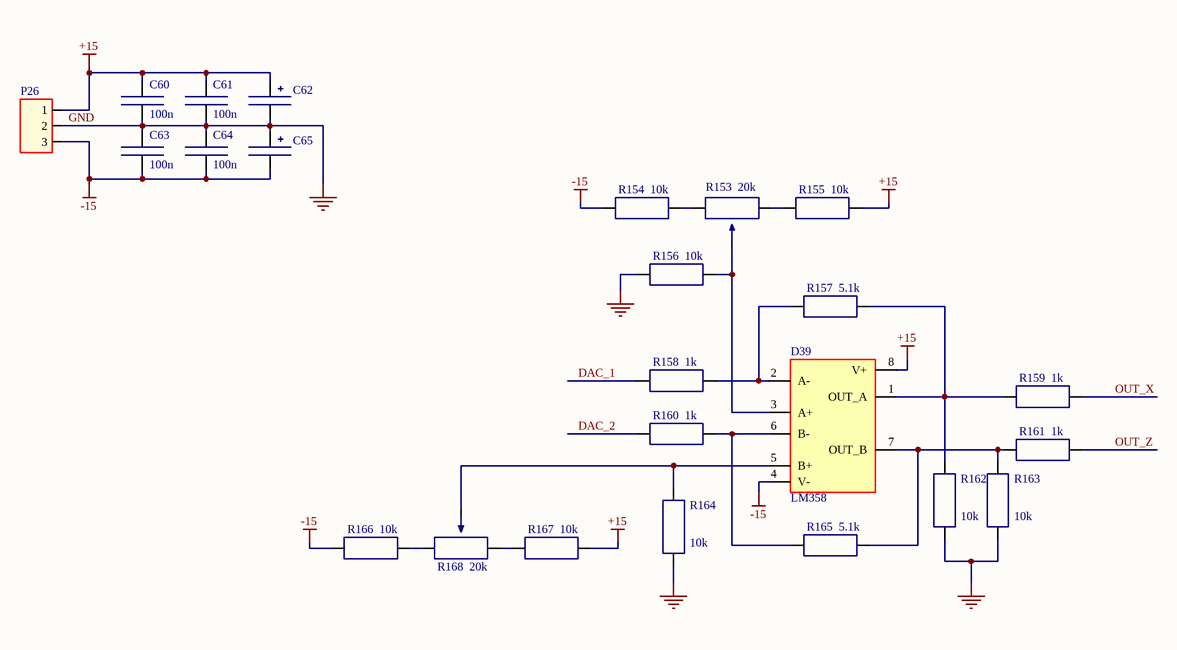
[diagram p4: Task.SchDoc]

### Parts
C60  100n  [C0805]
C61  100n  [C0805]
C62  Capacitor_Polyar  [SMD_El_SizeA]  (value not drawn)
C63  100n  [C0805]
C64  100n  [C0805]
C65  Capacitor_Polyar  [SMD_El_SizeA]  (value not drawn)
D39  LM358  [SOIC-8]
P26  KLS_3_5mm  [KLS_3_5MM]  (value not drawn)
R153  20k  [RES_POT_1]
R154  10k  [R0805]
R155  10k  [R0805]
R156  10k  [R0805]
R157  5.1k  [R0805]
R158  1k  [R0805]
R159  1k  [R0805]
R160  1k  [R0805]
R161  1k  [R0805]
R162  10k  [R0805]
R163  10k  [R0805]
R164  10k  [R0805]
R165  5.1k  [R0805]
R166  10k  [R0805]
R167  10k  [R0805]
R168  20k  [RES_POT_1]

### Nets
+15: C60.1 C61.1 C62.1 D39.8(V+) P26.1 R155.1 R167.1
-15: C63.2 C64.2 C65.2 D39.4(V-) P26.3 R154.2 R166.2
GND: C60.2 C61.2 C62.2 C63.1 C64.1 C65.1 P26.2 R156.2 R162.1 R163.1 R164.2
DAC_1: R158.2
DAC_2: R160.2
OUT_X: R159.1
OUT_Z: R161.1
NetD39_1: D39.1(OUT_A) R157.1 R159.2 R162.2
NetD39_2: D39.2(A-) R157.2 R158.1
NetD39_3: D39.3(A+) R153.3 R156.1
NetD39_5: D39.5(B+) R164.1 R168.3
NetD39_6: D39.6(B-) R160.1 R165.2
NetD39_7: D39.7(OUT_B) R161.2 R163.2 R165.1
NetR153_1: R153.1 R155.2
NetR153_2: R153.2 R154.1
NetR166_1: R166.1 R168.1
NetR167_2: R167.2 R168.2

### Library data of the parts
C60 C61 C63 C64 = C0805
R153 R168 = Res_Pot_1
R154-R167 = R0805

## Sheet connect.SchDoc
size A3
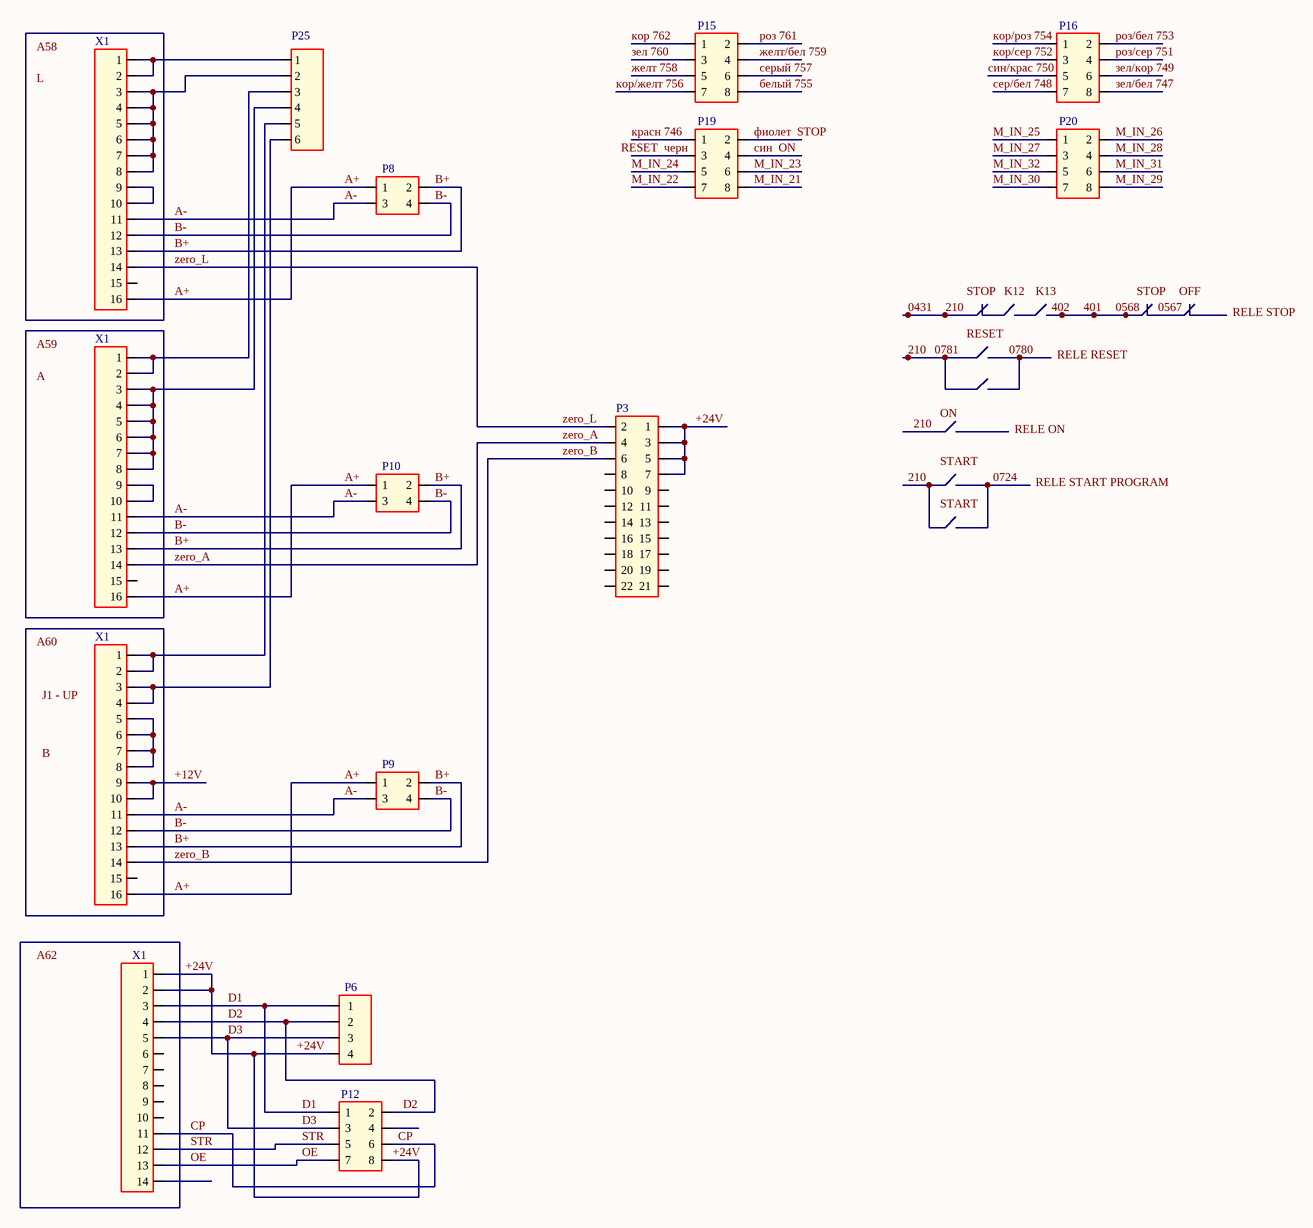
[diagram p5: connect.SchDoc]

### Parts
(Parts that share a designator on the sheet are numbered #1, #2 ... from top to bottom, then left to right.)
P3#2  Con_11x2  [Con_11x2]  (value not drawn)
P6#2  Con_4  [Con_4]  (value not drawn)
P8#2  Con_2x2  [Con_2x2]  (value not drawn)
P9#2  Con_2x2  [Con_2x2]  (value not drawn)
P10#2  Con_2x2  [Con_2x2]  (value not drawn)
P12#2  Con_4x2  [Con_4_2]  (value not drawn)
P15#2  Con_4x2  [Con_4_2]  (value not drawn)
P16#2  Con_4x2  [Con_4_2]  (value not drawn)
P19#2  Con_4x2  [Con_4_2]  (value not drawn)
P20#2  Con_4x2  [Con_4_2]  (value not drawn)
P25#2  KLS_6_5mm  [KLS_6_5MM]  (value not drawn)
X1#1  KLS_16_5mm  [KLS_16_5mm]  (value not drawn)
X1#2  KLS_16_5mm  [KLS_16_5mm]  (value not drawn)
X1#3  KLS_16_5mm  [KLS_16_5mm]  (value not drawn)
X1#4  KLS_14_5mm  (value not drawn)

### Nets
+12V: X1#3.9 X1#3.10
+24V: P3#2.1 P3#2.3 P3#2.5 P3#2.7 P6#2.4 P12#2.8 X1#4.1 X1#4.2
A+: P8#2.1 P9#2.1 P10#2.1 X1#1.16 X1#2.16 X1#3.16
A-: P8#2.3 P9#2.3 P10#2.3 X1#1.11 X1#2.11 X1#3.11
B+: P8#2.2 P9#2.2 P10#2.2 X1#1.13 X1#2.13 X1#3.13
B-: P8#2.4 P9#2.4 P10#2.4 X1#1.12 X1#2.12 X1#3.12
CP: P12#2.6 X1#4.11
D1: P6#2.1 P12#2.1 X1#4.3
D2: P6#2.2 P12#2.2 X1#4.4
D3: P6#2.3 P12#2.3 X1#4.5
M_IN_21: P19#2.8
M_IN_22: P19#2.7
M_IN_23: P19#2.6
M_IN_24: P19#2.5
M_IN_25: P20#2.1
M_IN_26: P20#2.2
M_IN_27: P20#2.3
M_IN_28: P20#2.4
M_IN_29: P20#2.8
M_IN_30: P20#2.7
M_IN_31: P20#2.6
M_IN_32: P20#2.5
OE: P12#2.7 X1#4.13
STR: P12#2.5 X1#4.12
zero_A: P3#2.4 X1#2.14
zero_B: P3#2.6 X1#3.14
zero_L: P3#2.2 X1#1.14
белый 755: P15#2.8
желт 758: P15#2.5
желт/бел 759: P15#2.4
зел 760: P15#2.3
зел/бел 747: P16#2.8
зел/кор 749: P16#2.6
кор 762: P15#2.1
кор/желт 756: P15#2.7
кор/роз 754: P16#2.1
кор/сер 752: P16#2.3
красн 746: P19#2.1
роз 761: P15#2.2
роз/бел 753: P16#2.2
роз/сер 751: P16#2.4
сер/бел 748: P16#2.7
серый 757: P15#2.6
син  ON: P19#2.4
син/крас 750: P16#2.5
фиолет  STOP: P19#2.2
NetP25#2_1: P25#2.1 X1#1.1 X1#1.2
NetP25#2_2: P25#2.2 X1#1.3 X1#1.4 X1#1.5 X1#1.6 X1#1.7 X1#1.8
NetP25#2_3: P25#2.3 X1#2.1 X1#2.2
NetP25#2_4: P25#2.4 X1#2.3 X1#2.4 X1#2.5 X1#2.6 X1#2.7 X1#2.8
NetP25#2_5: P25#2.5 X1#3.1 X1#3.2
NetP25#2_6: P25#2.6 X1#3.3 X1#3.4
NetX1#1_9: X1#1.9 X1#1.10
NetX1#2_9: X1#2.9 X1#2.10
NetX1#3_5: X1#3.5 X1#3.6 X1#3.7 X1#3.8

Not connected (* = marked no-connect by the designer): P3#2 8 9 10 11 12 13 14 15 16 17 18 19 20 21 22; P12#2 4; P19#2 3; X1#1 15; X1#2 15; X1#3 15; X1#4 6 7 8 9 10 14

### Notes on the sheet
- Labels drawn without touching a wire or pin: A, A58, A59, A60, A62, B, J1 - UP, K12, K13, L, OFF, ON, RELE ON, RELE RESET, RELE START PROGRAM, RELE STOP, RESET, RESET  черн, START, STOP

## Nets that join several sheets
+5V: control (25 pins), control_2 (R52.2), Res (34 pins), Supply (21 pins)
+15: control_2 (R53.2), Task (7 pins)
GND: control (86 pins), control_2 (8 pins), Res (30 pins), Supply (39 pins), Task (11 pins)
VCC: control (10 pins), Supply (9 pins)
+24V: control (6 pins), Supply (P4.8 P6#1.4 P12#1.8 P17.8), connect (8 pins)
B_1: control (D18.2 VT2.3), Res (R79.1)
B_2: control (D18.5 VT3.3), Res (R80.1)
B_3: control (D18.10 VT4.3), Res (R81.1)
D: control (D18.1 D18.4 D18.9 VT1.3), Res (R78.1)
DAC_1: control (D3.29), Task (R158.2)
DAC_2: control (D3.30), Task (R160.2)
En_OUT2: control (D3.45 D34.1 D34.19), Res (C31.1 R88.1)
I1: control (R1.1), Supply (P3#1.1)
I2: control (R4.1), Supply (P3#1.3)
I3: control (R7.1), Supply (P3#1.5)
I4: control (R9.1), Supply (P3#1.7)
I5: control (R13.1), Supply (P3#1.9)
I6: control (R2.1), Supply (P3#1.11)
I7: control (R5.1), Supply (P3#1.13)
I8: control (R8.1), Supply (P3#1.15)
I9: control (R10.1), Supply (P3#1.17)
I10: control (R14.1), Supply (P3#1.19)
I11: control (R17.1), Supply (P3#1.21)
I12: control (R18.1), Supply (P18.1)
I_11: control (D1.2), Supply (P3#1.2)
I_12: control (D4.2), Supply (P3#1.4)
I_13: control (D6.2), Supply (P3#1.6)
I_14: control (D8.2), Supply (P3#1.8)
I_15: control (D10.2), Supply (P3#1.10)
I_16: control (D2.2), Supply (P3#1.12)
I_17: control (D5.2), Supply (P3#1.14)
I_18: control (D7.2), Supply (P3#1.16)
I_19: control (D9.2), Supply (P3#1.18)
I_20: control (D11.2), Supply (P3#1.20)
I_21: control (D12.2), Supply (P3#1.22)
I_22: control (D13.2), Supply (P18.2)
IN_1_1: control (D1.4 D3.2), Res (C66.1 R169.1)
IN_1_2: control (D3.3 D4.4), Res (C67.1 R170.1)
IN_1_3: control (D3.4 D6.4), Res (C68.1 R171.1)
IN_1_4: control (D3.5 D8.4), Res (C69.1 R172.1)
IN_1_5: control (D3.7 D10.4), Res (C70.1 R173.1)
IN_1_6: control (D2.4 D3.8), Res (C71.1 R174.1)
IN_1_7: control (D3.9 D5.4), Res (C72.1 R175.1)
IN_1_8: control (D3.15 D7.4), Res (C73.1 R176.1)
IN_1_9: control (D3.16 D9.4), Res (C74.1 R177.1)
IN_1_10: control (D3.17 D11.4), Res (C75.1 R178.1)
IN_1_11: control (D3.18 D12.4), Res (C76.1 R179.1)
IN_2_1: control (D3.82 D14.5), Res (C21.1 R74.1)
IN_2_2: control (D3.83 D17.5), Res (C22.1 R75.1)
IN_2_3: control (D3.84 D21.5), Res (C23.1 R76.1)
IN_ADC_0: control (R38.1), Supply (P13.2)
IN_ADC_1: control (R39.1), Supply (P13.4)
IN_ADC_2: control (R40.1), Supply (P13.6)
IN_ADC_3: control (R45.1), Supply (P14.2)
IN_ADC_4: control (R46.1), Supply (P14.4)
IN_ADC_5: control (R47.1), Supply (P14.6)
M_IN_1: control (D26.15), Res (R89.1), Supply (P15#1.1)
M_IN_2: control (D26.14), Res (R90.1), Supply (P15#1.2)
M_IN_3: control (D26.13), Res (R91.1), Supply (P15#1.3)
M_IN_4: control (D26.12), Res (R92.1), Supply (P15#1.4)
M_IN_5: control (D26.1), Res (R93.1), Supply (P15#1.8)
M_IN_6: control (D26.2), Res (R94.1), Supply (P15#1.7)
M_IN_7: control (D26.3), Res (R95.1), Supply (P15#1.6)
M_IN_8: control (D26.4), Res (R96.1), Supply (P15#1.5)
M_IN_9: control (D27.15), Res (R97.1), Supply (P16#1.1)
M_IN_10: control (D27.14), Res (R98.1), Supply (P16#1.2)
M_IN_11: control (D27.13), Res (R99.1), Supply (P16#1.3)
M_IN_12: control (D27.12), Res (R100.1), Supply (P16#1.4)
M_IN_13: control (D27.1), Res (R101.1), Supply (P16#1.8)
M_IN_14: control (D27.2), Res (R102.1), Supply (P16#1.7)
M_IN_15: control (D27.3), Res (R103.1), Supply (P16#1.6)
M_IN_16: control (D27.4), Res (R104.1), Supply (P16#1.5)
M_IN_17: control (D28.15), Res (R105.1), Supply (P19#1.1)
M_IN_18: control (D28.14), Res (R106.1), Supply (P19#1.2)
M_IN_19: control (D28.13), Res (R107.1), Supply (P19#1.3)
M_IN_20: control (D28.12), Res (R127.1), Supply (P19#1.4)
M_IN_21: control (D28.1), Res (R128.1), Supply (P19#1.8), connect (P19#2.8)
M_IN_22: control (D28.2), Res (R129.1), Supply (P19#1.7), connect (P19#2.7)
M_IN_23: control (D28.3), Res (R130.1), Supply (P19#1.6), connect (P19#2.6)
M_IN_24: control (D28.4), Res (R131.1), Supply (P19#1.5), connect (P19#2.5)
M_IN_25: control (D29.15), Res (R132.1), Supply (P20#1.1), connect (P20#2.1)
M_IN_26: control (D29.14), Res (R133.1), Supply (P20#1.2), connect (P20#2.2)
M_IN_27: control (D29.13), Res (R134.1), Supply (P20#1.3), connect (P20#2.3)
M_IN_28: control (D29.12), Res (R135.1), Supply (P20#1.4), connect (P20#2.4)
M_IN_29: control (D29.1), Res (R136.1), Supply (P20#1.8), connect (P20#2.8)
M_IN_30: control (D29.2), Res (R137.1), Supply (P20#1.7), connect (P20#2.7)
M_IN_31: control (D29.3), Res (R138.1), Supply (P20#1.6), connect (P20#2.6)
M_IN_32: control (D29.4), Res (R139.1), Supply (P20#1.5), connect (P20#2.5)
M_Y1: control (D3.85 D26.5), Res (C17.1 R70.1)
M_Y2: control (D3.86 D27.5), Res (C18.1 R71.1)
M_Y3: control (D3.87 D28.5), Res (C19.1 R72.1)
M_Y4: control (D3.88 D29.5), Res (C20.1 R73.1)
O_1: control (D23.15), Supply (P21.1)
O_2: control (D23.1), Supply (P21.2)
O_3: control (D23.2), Supply (P21.3)
O_4: control (D23.3), Supply (P21.4)
O_5: control (D23.4), Supply (P21.5)
O_6: control (D23.5), Supply (P21.6)
O_7: control (D23.6), Supply (P21.7)
O_8: control (D23.7), Supply (P21.8)
O_9: control (D24.15), Supply (P22.1)
O_10: control (D24.1), Supply (P22.2)
O_11: control (D24.2), Supply (P22.3)
O_12: control (D24.3), Supply (P22.4)
O_13: control (D24.4), Supply (P22.5)
O_14: control (D24.5), Supply (P22.6)
O_15: control (D24.6), Supply (P22.7)
O_16: control (D24.7), Supply (P22.8)
O_17: control (D30.15), Supply (P23.1)
O_18: control (D30.1), Supply (P23.2)
O_19: control (D30.2), Supply (P23.3)
O_20: control (D30.3), Supply (P23.4)
O_21: control (D30.4), Supply (P23.5)
O_22: control (D30.5), Supply (P23.6)
O_23: control (D30.6), Supply (P23.7)
O_24: control (D30.7), Supply (P23.8)
O_25: control (D31.15), Supply (P24.1)
O_26: control (D31.1), Supply (P24.2)
O_27: control (D31.2), Supply (P24.3)
O_28: control (D31.3), Supply (P24.4)
O_29: control (D31.4), Supply (P24.5)
O_30: control (D31.5), Supply (P24.6)
O_31: control (D31.6), Supply (P24.7)
O_32: control (D31.7), Supply (P24.8)
OT10: control (R20.1), Supply (P7.2)
OT10_1: control (D15.3), Supply (P7.1)
OT11: control (R26.1), Supply (P7.4)
OT11_1: control (D16.3), Supply (P7.3)
OUT_3_1: control (D3.55), Supply (P2.3)
OUT_3_2: control (D3.56), Supply (P2.4)
OUT_3_3: control (D3.57), Supply (P2.1)
OUT_3_4: control (D3.58), Supply (P2.2)
OUT_X: Supply (P25#1.1), Task (R159.1)
OUT_Y+: control_2 (C14.1 C16.1 VT6.3 VT10.3), Supply (P25#1.5)
OUT_Y-: control_2 (C13.2 C15.2 R67.1 R69.1), Supply (P25#1.6)
OUT_Z: Supply (P25#1.3), Task (R161.1)
RX_3: control (D3.48), Supply (P11.3)
SPI2_MISO: control (D3.53), Supply (P2.5)
SPI2_MOSI: control (D3.54), Supply (P2.6)
SPI2_NSS: control (D3.51), Supply (P2.7)
SPI2_SCK: control (D3.52), Supply (P2.8)
T1_BKIN: control (D3.46 D13.4), Res (C24.1 R77.1)
T9_1: control (D3.25), control_2 (R60.1 R64.1)
T9_2: control (D3.26), control_2 (R59.1 R62.2)
T_1: control (D14.3 VD1.1), Supply (P6#1.1)
T_2: control (D17.3 VD2.1), Supply (P6#1.2)
T_3: control (D21.3 VD3.1), Supply (P6#1.3)
TX_3: control (D3.47), Supply (P11.2)
X_A: control (D3.77 D22.5), Res (C25.1 R82.1)
X_A+: control (R30.1), Supply (P8#1.1)
X_A-: control (D22.3 VD4.1), Supply (P8#1.3)
X_B: control (D3.89 D25.5), Res (C26.1 R83.1)
X_B+: control (R33.1), Supply (P8#1.2)
X_B-: control (D25.3 VD5.1), Supply (P8#1.4)
Y1: control (D35.16), Supply (P4.1)
Y2: control (D35.15), Supply (P4.2)
Y3: control (D35.14), Supply (P4.3)
Y4: control (D35.13), Supply (P4.4)
Y5: control (D35.12), Supply (P4.5)
Y6: control (D35.11), Supply (P4.6)
Y7: control (D35.10), Supply (P4.7)
Y8: control (D20.16), Supply (P12#1.1)
Y9: control (D20.15), Supply (P12#1.2)
Y10: control (D20.14), Supply (P12#1.3)
Y11: control (D20.13), Supply (P12#1.4)
Y12: control (D20.12), Supply (P12#1.5)
Y13: control (D20.11), Supply (P12#1.6)
Y14: control (D20.10), Supply (P12#1.7)
Y_15: control (D19.16), Supply (P17.1)
Y_16: control (D19.15), Supply (P17.2)
Y_17: control (D19.14), Supply (P17.3)
Y_18: control (D19.13), Supply (P17.4)
Y_19: control (D19.12), Supply (P17.5)
Y_20: control (D19.11), Supply (P17.6)
Y_21: control (D19.10), Supply (P17.7)
Y_A: control (D3.90 D32.5), Res (C27.1 R84.1)
Y_A+: control (R36.1), Supply (P9#1.1)
Y_A-: control (D32.3 VD6.1), Supply (P9#1.3)
Y_B: control (D3.91 D33.5), Res (C28.1 R85.1)
Y_B+: control (R37.1), Supply (P9#1.2)
Y_B-: control (D33.3 VD7.1), Supply (P9#1.4)
Z_A: control (D3.23 D36.5), Res (C29.1 R86.1)
Z_A+: control (R44.1), Supply (P10#1.1)
Z_A-: control (D36.3 VD11.1), Supply (P10#1.3)
Z_B: control (D3.24 D37.5), Res (C30.1 R87.1)
Z_B+: control (R51.1), Supply (P10#1.2)
Z_B-: control (D37.3 VD15.1), Supply (P10#1.4)